# EAGLE design LightStickV1.1 (EAGLE 6.2)
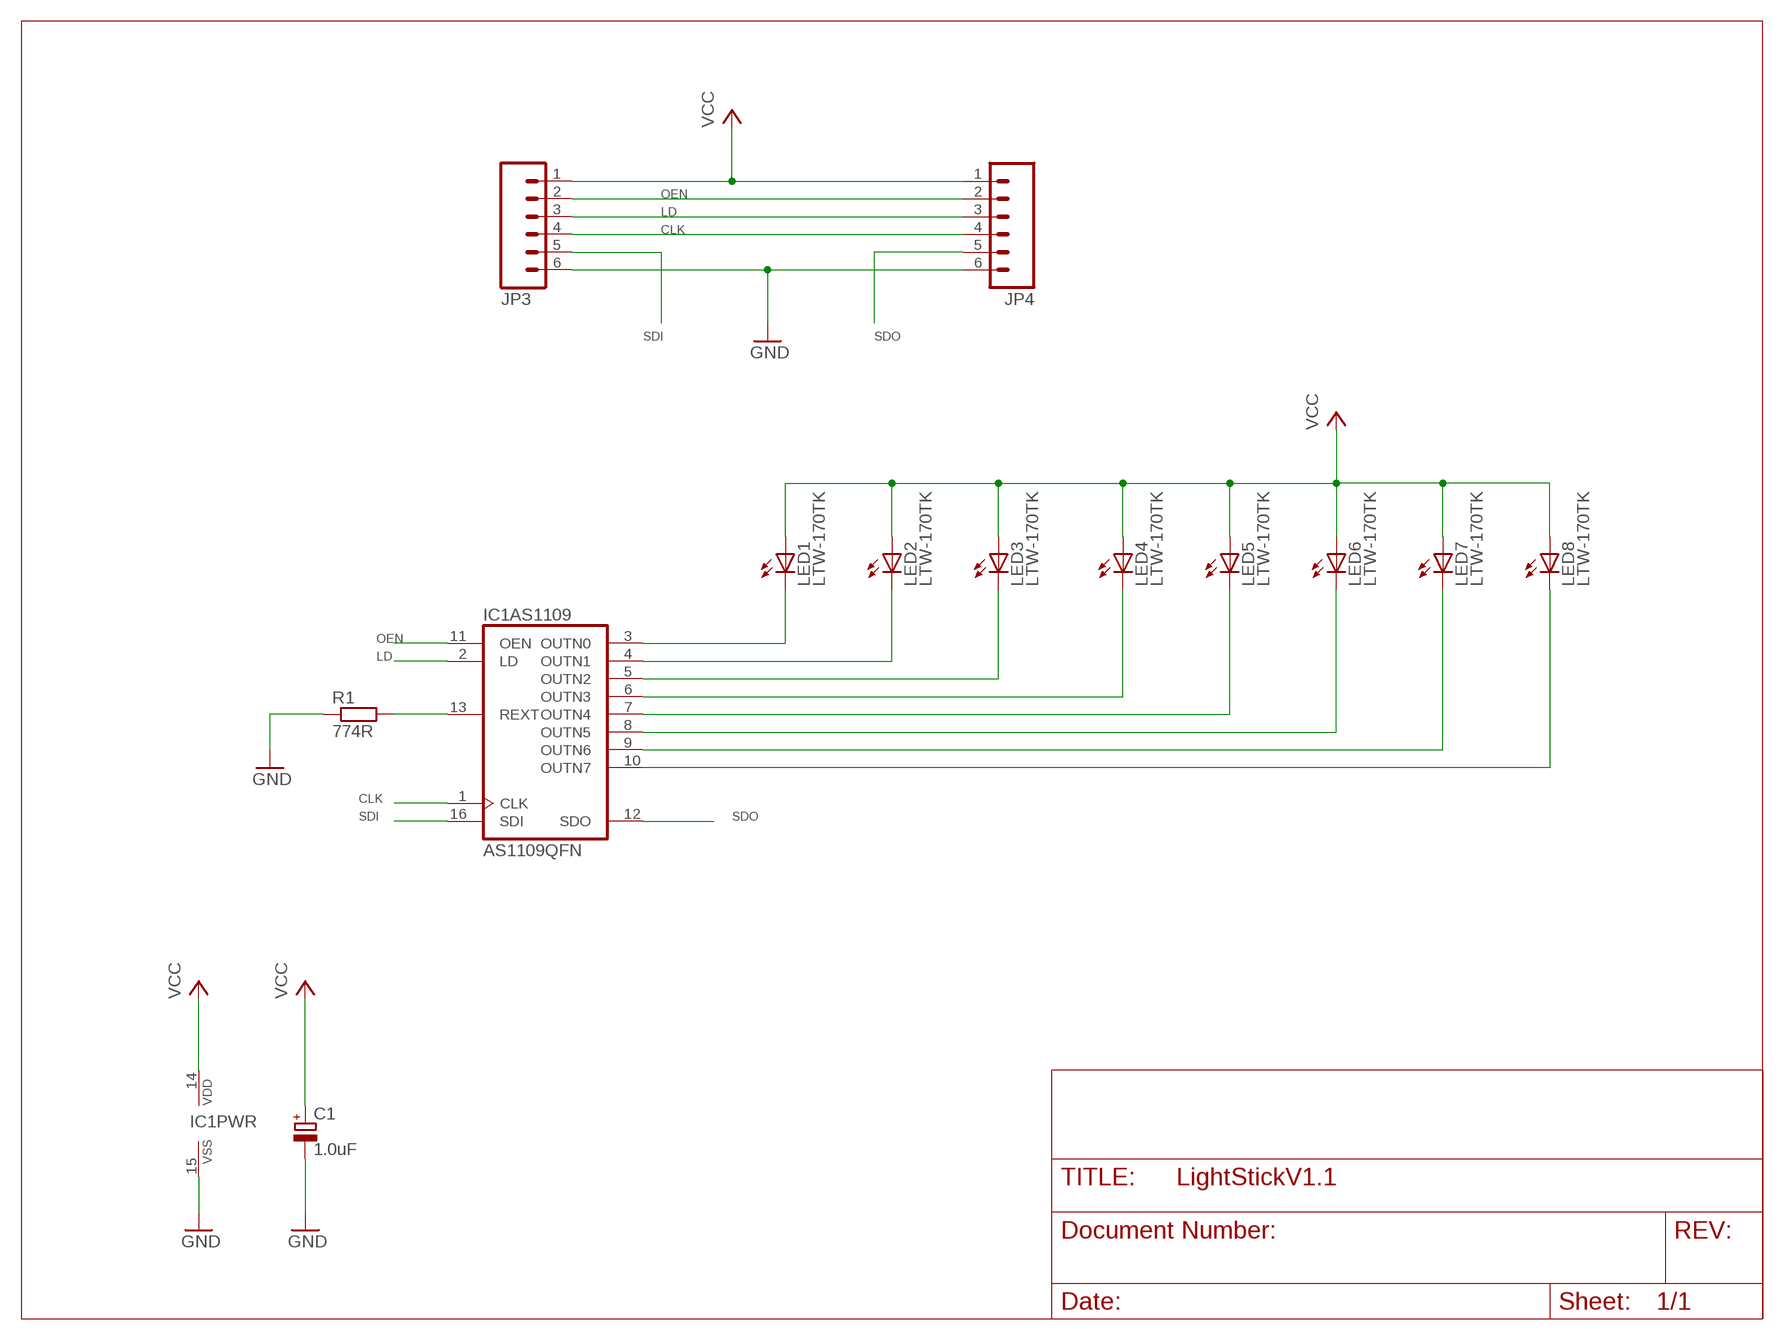
[diagram p0: schematic, sheet 1]

## Parts
C1  1.0uF  CPOL-EUSMCB  [SMC_B]
IC1  AS1109QFN  [QFN16-HS]
JP3  M06LOCK  [1X06_LOCK]
JP4  M06LOCK  [1X06_LOCK]
LED1  LTW-170TK  LEDCHIPLED_0805  [CHIPLED_0805]
LED2  LTW-170TK  LEDCHIPLED_0805  [CHIPLED_0805]
LED3  LTW-170TK  LEDCHIPLED_0805  [CHIPLED_0805]
LED4  LTW-170TK  LEDCHIPLED_0805  [CHIPLED_0805]
LED5  LTW-170TK  LEDCHIPLED_0805  [CHIPLED_0805]
LED6  LTW-170TK  LEDCHIPLED_0805  [CHIPLED_0805]
LED7  LTW-170TK  LEDCHIPLED_0805  [CHIPLED_0805]
LED8  LTW-170TK  LEDCHIPLED_0805  [CHIPLED_0805]
R1  774R  R-EU_R0805  [R0805]

## Nets
CLK: IC1.1(AS1109:CLK) JP3.4 JP4.4
GND [supply]: C1.- IC1.15(PWR:VSS) JP3.6 JP4.6 R1.1
LD: IC1.2(AS1109:LD) JP3.3 JP4.3
N$1: IC1.3(AS1109:OUTN0) LED1.C
N$2: IC1.4(AS1109:OUTN1) LED2.C
N$3: IC1.5(AS1109:OUTN2) LED3.C
N$4: IC1.6(AS1109:OUTN3) LED4.C
N$5: IC1.7(AS1109:OUTN4) LED5.C
N$6: IC1.8(AS1109:OUTN5) LED6.C
N$7: IC1.13(AS1109:REXT) R1.2
N$8: IC1.9(AS1109:OUTN6) LED7.C
N$9: IC1.10(AS1109:OUTN7) LED8.C
OEN: IC1.11(AS1109:OEN) JP3.2 JP4.2
SDI: IC1.16(AS1109:SDI) JP3.5
SDO: IC1.12(AS1109:SDO) JP4.5
VCC [supply]: C1.+ IC1.14(PWR:VDD) JP3.1 JP4.1 LED1.A LED2.A LED3.A LED4.A LED5.A LED6.A LED7.A LED8.A
Unconnected: IC1.PAD

## Library data of the parts
C1 = rcl:CPOL-EU: POLARIZED CAPACITOR, European symbol
IC1 = Tabber:AS1109
JP3 JP4 = SparkFun:M06: Header 6 Standard 6-pin 0.1" header. Use with straight break away headers (SKU : PRT-00116), right angle break away headers (PRT-00553), swiss pins (PRT-00743), machine pins (PRT-00117), and female headers (PRT-00115). Molex polarized connector foot print use with SKU : PRT-08094 with associated crimp pins and housings. NOTES ON THE VARIANTS LOCK and LOCK_LONGPADS... This footprint was designed to help hold the alignment of a through-hole component (i.e. 6-pin header) while soldering it into place. You may notice that each hole has been shifted either up or down by 0.005 of an inch from it's more standard position (which is a perfectly straight line). This slight alteration caused the pins (the squares in the middle) to touch the edges of the holes. Because they are alternating, it causes a "brace" to hold the component in place. 0.005 has proven to be the perfect amount of "off-center" position when using our standard breakaway headers. Although looks a little odd when you look at the bare footprint, once you have a header in there, the alteration is very hard to notice. Also, if you push a header all the way into place, it is covered up entirely on the bottom side. This idea of altering the position of holes to aid alignment will be further integrated into the Sparkfun Library for other footprints. It can help hold any component with 3 or more connection pins.
LED1-LED8 = Tabber:LED: LED OSRAM: - CHIPLED LG R971, LG N971, LY N971, LG Q971, LY Q971, LO R971, LY R971 LH N974, LH R974 LS Q976, LO Q976, LY Q976 LO Q996 - Hyper CHIPLED LW Q18S LB Q993, LB Q99A, LB R99A - SideLED LS A670, LO A670, LY A670, LG A670, LP A670 LB A673, LV A673, LT A673, LW A673 LH A674 LY A675 LS A676, LA A676, LO A676, LY A676, LW A676 LS A679, LY A679, LG A679 - Hyper Micro SIDELED® LS Y876, LA Y876, LO Y876, LY Y876 LT Y87S - SmartLED LW L88C, LW L88S LB L89C, LB L89S, LG L890 LS L89K, LO L89K, LY L89K LS L896, LA L896, LO L896, LY L896 - TOPLED LS T670, LO T670, LY T670, LG T670, LP T670 LSG T670, LSP T670, LSY T670, LOP T670, LYG T670 LG T671, LOG T671, LSG T671 LB T673, LV T673, LT T673, LW T673 LH T674 LS T676, LA T676, LO T676, LY T676, LB T676, LH T676, LSB T676, LW T676 LB T67C, LV T67C, LT T67C, LS T67K, LO T67K, LY T67K, LW E67C LS E67B, LA E67B, LO E67B, LY E67B, LB E67C, LV E67C, LT E67C LW T67C LS T679, LY T679, LG T679 LS T770, LO T770, LY T770, LG T770, LP T770 LB T773, LV T773, LT T773, LW T773 LH T774 LS E675, LA E675, LY E675, LS T675 LS T776, LA T776, LO T776, LY T776, LB T776 LHGB T686 LT T68C, LB T68C - Hyper Mini TOPLED® LB M676 - Mini TOPLED Santana® LG M470 LS M47K, LO M47K, LY M47K Source: http://www.osram.convergy.de LUXEON: - LUMILED® LXK2-PW12-R00, LXK2-PW12-S00, LXK2-PW14-U00, LXK2-PW14-V00 LXK2-PM12-R00, LXK2-PM12-S00, LXK2-PM14-U00 LXK2-PE12-Q00, LXK2-PE12-R00, LXK2-PE12-S00, LXK2-PE14-T00, LXK2-PE14-U00 LXK2-PB12-K00, LXK2-PB12-L00, LXK2-PB12-M00, LXK2-PB14-N00, LXK2-PB14-P00, LXK2-PB14-Q00 LXK2-PR12-L00, LXK2-PR12-M00, LXK2-PR14-Q00, LXK2-PR14-R00 LXK2-PD12-Q00, LXK2-PD12-R00, LXK2-PD12-S00 LXK2-PH12-R00, LXK2-PH12-S00 LXK2-PL12-P00, LXK2-PL12-Q00, LXK2-PL12-R00 Source: www.luxeon.com KINGBRIGHT: KA-3528ASYC Source: www.kingbright.com
R1 = rcl:R-EU_: RESISTOR, European symbol

## Net classes
1 supply: width 0.305 mm

## Board
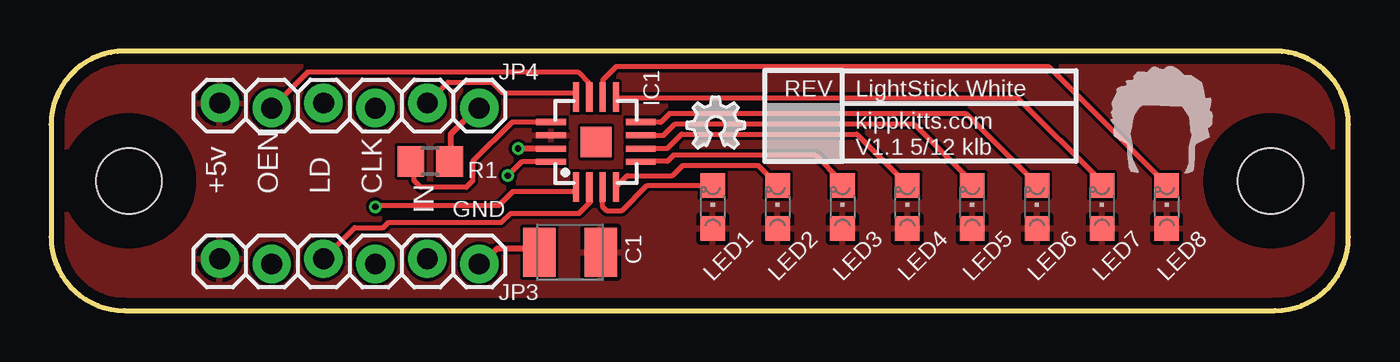
[diagram p1: board, top side]
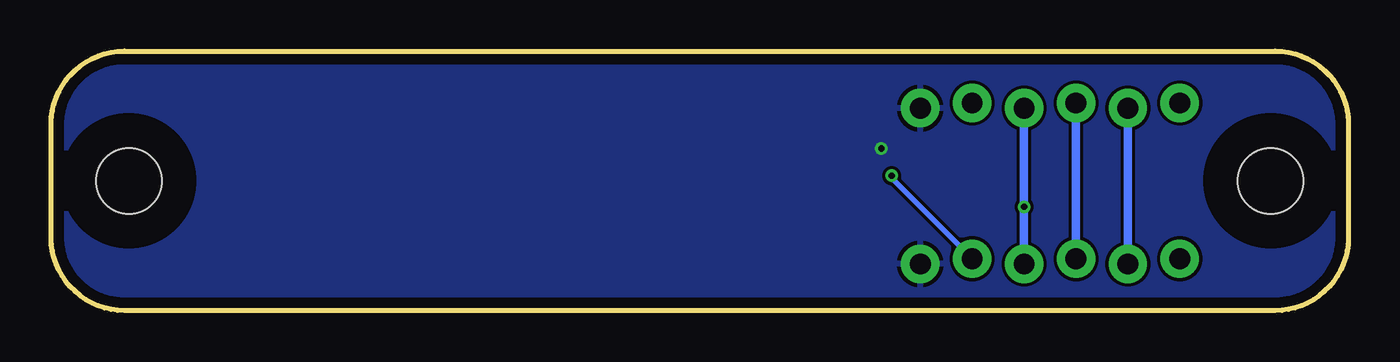
[diagram p2: board, bottom side, seen from below]

Size 63.5 x 12.7 mm. Coordinates in mm from the lower left corner, seen from the top.
Outline: 59.91,12.7 3.59,12.7 arc90 0,9.11 0,3.59 arc90 3.59,0 59.91,0 arc90 63.5,3.59 63.5,9.11 arc90 59.91,12.7
Copper layers (1*16): Top 0.035mm / dielectric 1.5mm / Bottom 0.035mm
Design rules: minimum track width 6mil, minimum drill 12mil, track to track 6mil, track to pad 6mil, pad to pad 6mil, via to via 6mil, smd to smd 6mil, copper to edge 20mil, drill to drill 8mil, minimum pad ring 8mil, minimum via ring 6mil, stop-mask expansion 3mil, vias tented up to drill 0mil, thermal gap 8mil
Holes 3.2 mm at 59.69,6.35 3.81,6.35
tRestrict: area 56.5,3.2 to 62.9,9.5; area 0.6,3.2 to 7,9.5
bRestrict: area 0.6,3.2 to 7,9.5; area 56.5,3.2 to 62.9,9.5

### Footprints (pad centres in the part's own frame; a part is rotated, then mirrored left to right if it is on the bottom)
SMC_B = smd 1.6 x 2.4: + -1.5,0; - 1.5,0
QFN16-HS = smd 1.45 x 0.3: 1 -2.2,0.975; 2 -2.2,0.325; 3 -2.2,-0.325; 4 -2.2,-0.975; 9 2.2,-0.975; 10 2.2,-0.325; 11 2.2,0.325; 12 2.2,0.975 | smd 0.3 x 1.45: 5 -0.975,-2.2; 6 -0.325,-2.2; 7 0.325,-2.2; 8 0.975,-2.2; 13 0.975,2.2; 14 0.325,2.2; 15 -0.325,2.2; 16 -0.975,2.2 | smd 1.5 x 1.5: PAD 0,0
1X06_LOCK = drill 1.016 pad 1.88: 1 0,0; 2 2.54,-0.254; 3 5.08,0; 4 7.62,-0.254; 5 10.16,0; 6 12.7,-0.254
CHIPLED_0805 = smd 1.2 x 1.2: A 0,-1.05; C 0,1.05
R0805 = smd 1.3 x 1.5: 1 -0.95,0; 2 0.95,0

### Placement (x,y rotation side)
C1  25.4,2.86 180 top
DRILEGEND  [DRILEGEND]  -0.76,-5.21 0 top  (outside the outline)
IC1  26.67,8.26 90 top
JP3  8.26,2.54 0 top
JP4  8.26,10.16 0 top
LED1  32.38,5.08 0 top
LED2  35.56,5.08 0 top
LED3  38.73,5.08 0 top
LED4  41.91,5.08 0 top
LED5  45.09,5.08 0 top
LED6  48.26,5.08 0 top
LED7  51.44,5.08 0 top
LED8  54.61,5.08 0 top
R1  18.55,7.3 180 top
U$1  [TOP_DOCU_5MM]  51.12,6.03 0 top
U$2  [OSHW_FILLX100_NOTEXT]  31.11,7.94 0 top

### Tracks (layer width: path | path; a pad name or v marks a point on that pad's centre or on a via)
CLK  (via drill 0.3)
  Top 0.152: 25.65,5.84 IC1.1
  Top 0.254: 25.65,5.84 22.61,5.84 21.91,5.14 15.94,5.14 v15.88,5.08
  Bottom 0.406: JP3.4 v15.88,5.08 JP4.4
GND  (via drill 0.3)
  Top 0.305: R1.1 19.56,7.37 19.56,8.64 20.83,9.91 JP4.6 | IC1.15 v22.87,7.93 v22.86,7.94 | C1.- 23.88,3.05 21.84,3.05 21.08,2.29 JP3.6
  pour Bottom: -0.64,13.97 64.14,13.97 64.14,-1.27 -0.64,-1.27
LD
  Top 0.152: 26.42,5.33 26.42,5.84 IC1.2
  Top 0.254: 26.35,6.03 26.35,6.05 IC1.2 | 26.42,5.33 25.84,4.76 22.48,4.76 22.04,4.32 16.51,4.32 16.26,4.06 14.86,4.06 JP3.3
  Bottom 0.406: JP4.3 JP3.3
N$1
  Top 0.152: 32.26,6.1 LED1.C | 26.92,5.84 IC1.3
  Top 0.254: IC1.3 27,5.07 27.18,4.89 27.94,4.89 29.18,6.13 LED1.C
N$2
  Top 0.152: 35.56,6.35 LED2.C | 27.69,6.1 IC1.4
  Top 0.254: 27.69,6.1 28.19,6.6 30.42,6.6 30.92,7.11 34.61,7.11 35.37,6.35 35.37,6.32 LED2.C
N$3
  Top 0.254: LED3.C 38.61,6.35 38.67,6.35 37.4,7.62 30.48,7.62 30.16,7.3 28.89,7.3 IC1.5
N$4
  Top 0.152: 41.91,6.35 LED4.C
  Top 0.254: IC1.6 30.16,7.93 30.86,8.64 39.43,8.64 41.72,6.35 41.72,6.32 LED4.C
N$5
  Top 0.152: 44.96,6.35 LED5.C
  Top 0.254: IC1.7 29.98,8.58 30.54,9.14 42.23,9.14 45.02,6.35 44.96,6.35
N$6
  Top 0.254: IC1.8 28.89,9.21 29.84,9.21 30.29,9.65 44.77,9.65 48.07,6.35 48.07,6.32 LED6.C
  Top 0.305: 48.26,6.35 LED6.C
N$7
  Top 0.254: IC1.13 22.57,9.23 20.64,7.3 20.64,6.35 20.32,6.03 18.1,6.03 17.78,6.35 17.78,7.13
  Top 0.305: 17.78,7.13 R1.2
N$8
  Top 0.152: 51.31,6.35 LED7.C | 27.69,10.41 IC1.9
  Top 0.254: 27.69,10.41 47.31,10.41 51.37,6.35 51.31,6.35
N$9
  Top 0.152: 54.61,6.35 LED8.C
  Top 0.254: 26.99,10.46 IC1.10 27,11.28 27.65,11.94 48.83,11.94 54.42,6.35 54.61,6.35
OEN
  Top 0.254: IC1.11 26.35,11.11 25.78,11.68 12.57,11.68 JP4.2
  Bottom 0.406: JP4.2 JP3.2
SDI  (via drill 0.3)
  Top 0.254: IC1.16 23.03,7.28 v22.35,6.6
  Bottom 0.254: v22.35,6.6 22.35,6.48 JP3.5
SDO
  Top 0.152: 25.65,10.67 IC1.12
  Top 0.254: 25.65,10.67 22.1,10.67 21.59,11.18 19.43,11.18 JP4.5
VCC
  pour Top: -0.64,13.34 64.14,13.34 64.14,-0.64 -0.64,-0.64

### Text on the board
tPlace: REV | LightStick White | kippkitts.com | V1.1 5/12 klb | +5v | OEN | LD | CLK | IN | GND
DrillLegend: mm | mm | Two headers are .1" pitch headers, 6 long | Every other drill is shifted down .01" below the standard y value | First and second holes marked, rest can be extrapolated | 4 bevelled corners, 0.14142126" radius | .325", .4" | +.1", .39" | .9", .3125" | .15", .25" | 2.35", .25" | .625", .2" | .88", .26" | .325", .1" | +.1", 0.09"